# Altium schematic sheet Baro_Mag.SchDoc
size 420 x 297 mm; SheetNumber: 5; SheetTotal: 7
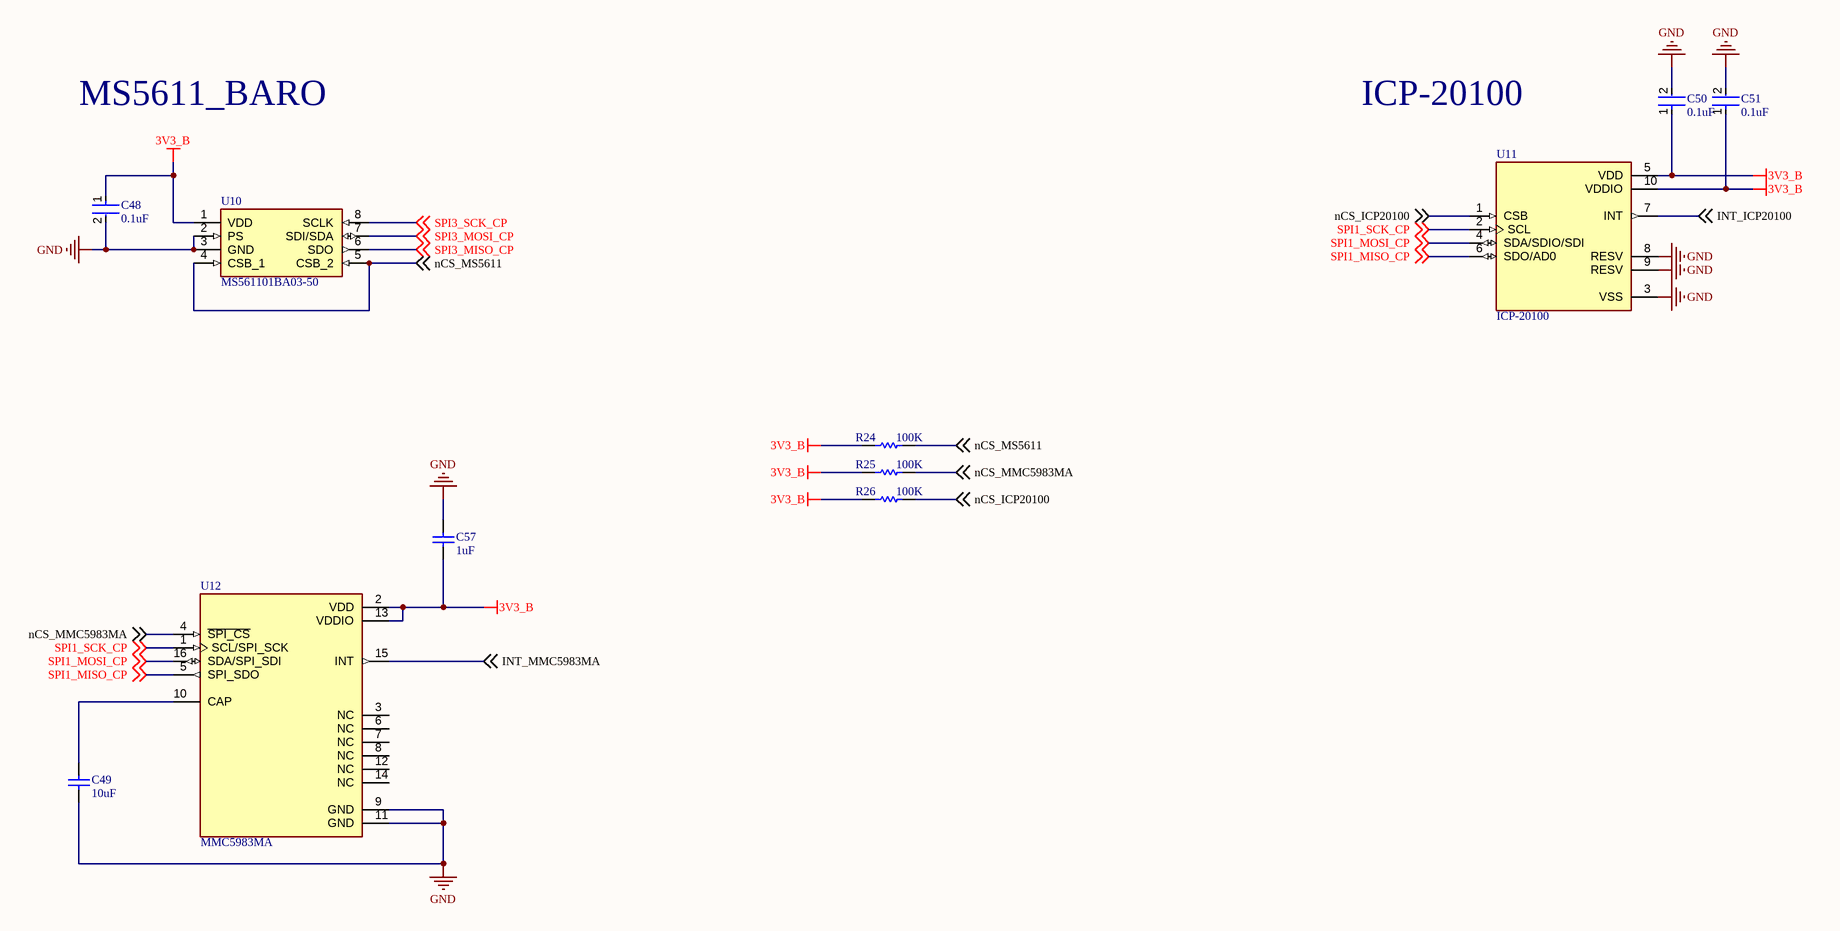
[diagram p0: Baro_Mag.SchDoc]

## Parts
C48  0.1uF  [FP-C0603C-CF-MFG]
C49  10uF  [CAPC2013X145X50LL20T25]
C50  0.1uF  [FP-C0603C-CF-MFG]
C51  0.1uF  [FP-C0603C-CF-MFG]
C57  1uF  [CAPC1608X90X35LL15T15]
R24  100K  [RESC1608X55X30ML20T10]
R25  100K  [RESC1608X55X30ML20T10]
R26  100K  [RESC1608X55X30ML20T10]
U10  MS561101BA03-50  [MS561101BA03-50]
U11  ICP-20100  [PQFN50P200X200X85-10N]
U12  MMC5983MA  [PQFN50P300X300X100-16N]

## Nets
3V3_B: C48.1 C50.1 C51.1 C57.1 R24.2 R25.2 R26.2 U10.1(VDD) U11.5(VDD) U11.10(VDDIO) U12.2(VDD) U12.13(VDDIO)
GND: C48.2 C49.2 C50.2 C51.2 C57.2 U10.2(PS) U10.3(GND) U11.3(VSS) U11.8(RESV) U11.9(RESV) U12.9(GND) U12.11(GND)
INT_ICP20100: U11.7(INT) ; off-sheet INT_ICP20100
INT_MMC5983MA: U12.15(INT) ; off-sheet INT_MMC5983MA
nCS_ICP20100: R26.1 U11.1(CSB) ; off-sheet nCS_ICP20100
nCS_MMC5983MA: R25.1 U12.4(~{SPI_CS}) ; off-sheet nCS_MMC5983MA
nCS_MS5611: R24.1 U10.4(CSB_1) U10.5(CSB_2) ; off-sheet nCS_MS5611
SPI1_MISO_CP: U11.6(SDO/AD0) U12.5(SPI_SDO) ; off-sheet SPI1_MISO_CP
SPI1_MOSI_CP: U11.4(SDA/SDIO/SDI) U12.16(SDA/SPI_SDI) ; off-sheet SPI1_MOSI_CP
SPI1_SCK_CP: U11.2(SCL) U12.1(SCL/SPI_SCK) ; off-sheet SPI1_SCK_CP
SPI3_MISO_CP: U10.6(SDO) ; off-sheet SPI3_MISO_CP
SPI3_MOSI_CP: U10.7(SDI/SDA) ; off-sheet SPI3_MOSI_CP
SPI3_SCK_CP: U10.8(SCLK) ; off-sheet SPI3_SCK_CP
NetC49_1: C49.1 U12.10(CAP)

Not connected (* = marked no-connect by the designer): U12 3(NC) 6(NC) 7(NC) 8(NC) 12(NC) 14(NC)

## Notes on the sheet
- MS5611_BARO
- ICP-20100
- THIS DOCUMENT AND THE DATA DISCLOSED HEREIN OR
- HEREWITH IS THE PROPERTY OF ALTIUM LIMITED AND MAY
- DWG NO:
- REVISION
- REV:
- DESCRIPTION
- DATE
- APPROVED
- BE FREELY DISTRIBUTED IN WHOLE. NO RIGHTS ARE
- RESERVED OR EXPRESS OR IMPLIED WARANTEE GIVEN.
- ENG:
- APPROVALS
- PROJECT
- DSN:
- CHK:
- REFERENCE DOCUMENTS
- PROJECT REVISION:
- TITLE
- DOCUMENT REVISION:
- DESIGN ITEM:
- BOM:
- FAB DWG:
- PCB DWG:
- ASSY DWG:
- SCALE:
- A3
- SIZE
- CAGE CODE
- FILE NAME
- DWG NO.
- SHEET
- OF
- REV

## Library data of the parts
C48 C50 C51 = CMP-2006-03061-2: CAP CER 0.1UF 50V X7R 0603; Manufacturer: KEMET; Manufacturer Part Number: C0603C104K5RACTU; Tolerance: 0.1; Temperature Coefficient: 30ppm/°C; Material: Ceramic; Automotive Grade: Grade 1; Value: 0.10 μF; Temperature: -55°C to +125°C; RoHS: TRUE; Temperature Range High: +125°C; Lead Free: Yes; Octopart: https://octopart.com/c0603c104k5ractu-kemet-139244; Digikey Description: CAP CER 0.1UF 50V X7R 0603; Category: Cap; Package: C0603C-CF; ComponentLink2Description: Datasheet; Temperature Range Low: -55°C; Device Class L1: Passive Components; Voltage Rating: 50 V; Automotive: Yes; Device Class L3: Ceramic Capacitors; ComponentLink2URL: https://api.kemet.com/component-edge/download/datasheet/C0603C100J5GACAUTO.pdf; Capacitance: 0.10 μF; Device Class L2: Capacitors; Temperature Characteristic: X7R; Height: 0.87mm
C49 = CMP-2007-01044-1: Manufacturer: Kemet; Part Number: C0805C106K8RACTU
C57 = CMP-2006-02298-2: Manufacturer: Kemet; Part Number: C0603C105K4RACTU
R24-R26 = CMP-2000-01852-1: Part Number: RK73B1JTTD104J; Manufacturer: KOA Speer
U10 = MS561101BA03-50: Integrated Circuit; Manufacturer_Name: TE Connectivity; Datasheet Link: https://www.te.com/commerce/DocumentDelivery/DDEController?Action=srchrtrv&DocNm=MS5611-01BA03&DocType=Data%20Sheet&DocLang=English&PartCntxt=MS561101BA03-50&DocFormat=pdf; Manufacturer_Part_Number: MS561101BA03-50; Mouser Part Number: 824-MS561101BA03-50; Mouser Price/Stock: https://www.mouser.co.uk/ProductDetail/Measurement-Specialties/MS561101BA03-50?qs=%252BgKeJhng5iV%252BnCz6Qd5iDw%3D%3D; Arrow Part Number: MS561101BA03-50; Arrow Price/Stock: https://www.arrow.com/en/products/ms561101ba03-50/te-connectivity?utm_currency=USD&region=nac
U11 = CMP-010-00027-1: MF: TDK InvenSense; Availability: Not in stock; SnapEDA_Link: https://www.snapeda.com/parts/ICP-20100/TDK%20InvenSense/view-part/7331147/?ref=snap; Check_prices: https://www.snapeda.com/parts/ICP-20100/TDK%20InvenSense/view-part/7331147/?ref=eda; Source: ICP-20100.SchLib; Pins: 10; Value: *; Component Type: Standard; Case/Package: None; Design Item ID: ICP-20100; Price: None; MP: ICP-20100
U12 = CMP-051-000000-1: MMC5983 series Magnetic, Magnetometer Sensor Evaluation Board; MF: Memsic Inc.; Component Type: Standard; Price: None; Source: MMC5983MA.SchLib; Value: *; MP: MMC5983MA; Design Item ID: MMC5983MA; Package: VFLGA-16 Memsic Inc.; Pin Count: 16; Availability: In Stock; Purchase-URL: https://pricing.snapeda.com/search/part/MMC5983MA/?ref=eda; SnapEDA_Link: https://www.snapeda.com/parts/MMC5983MA/Memsic+Inc./view-part/?ref=snap; Check_prices: https://www.snapeda.com/parts/MMC5983MA/Memsic+Inc./view-part/?ref=eda